# Altium schematic sheet FPGA.SCHDOC
size B
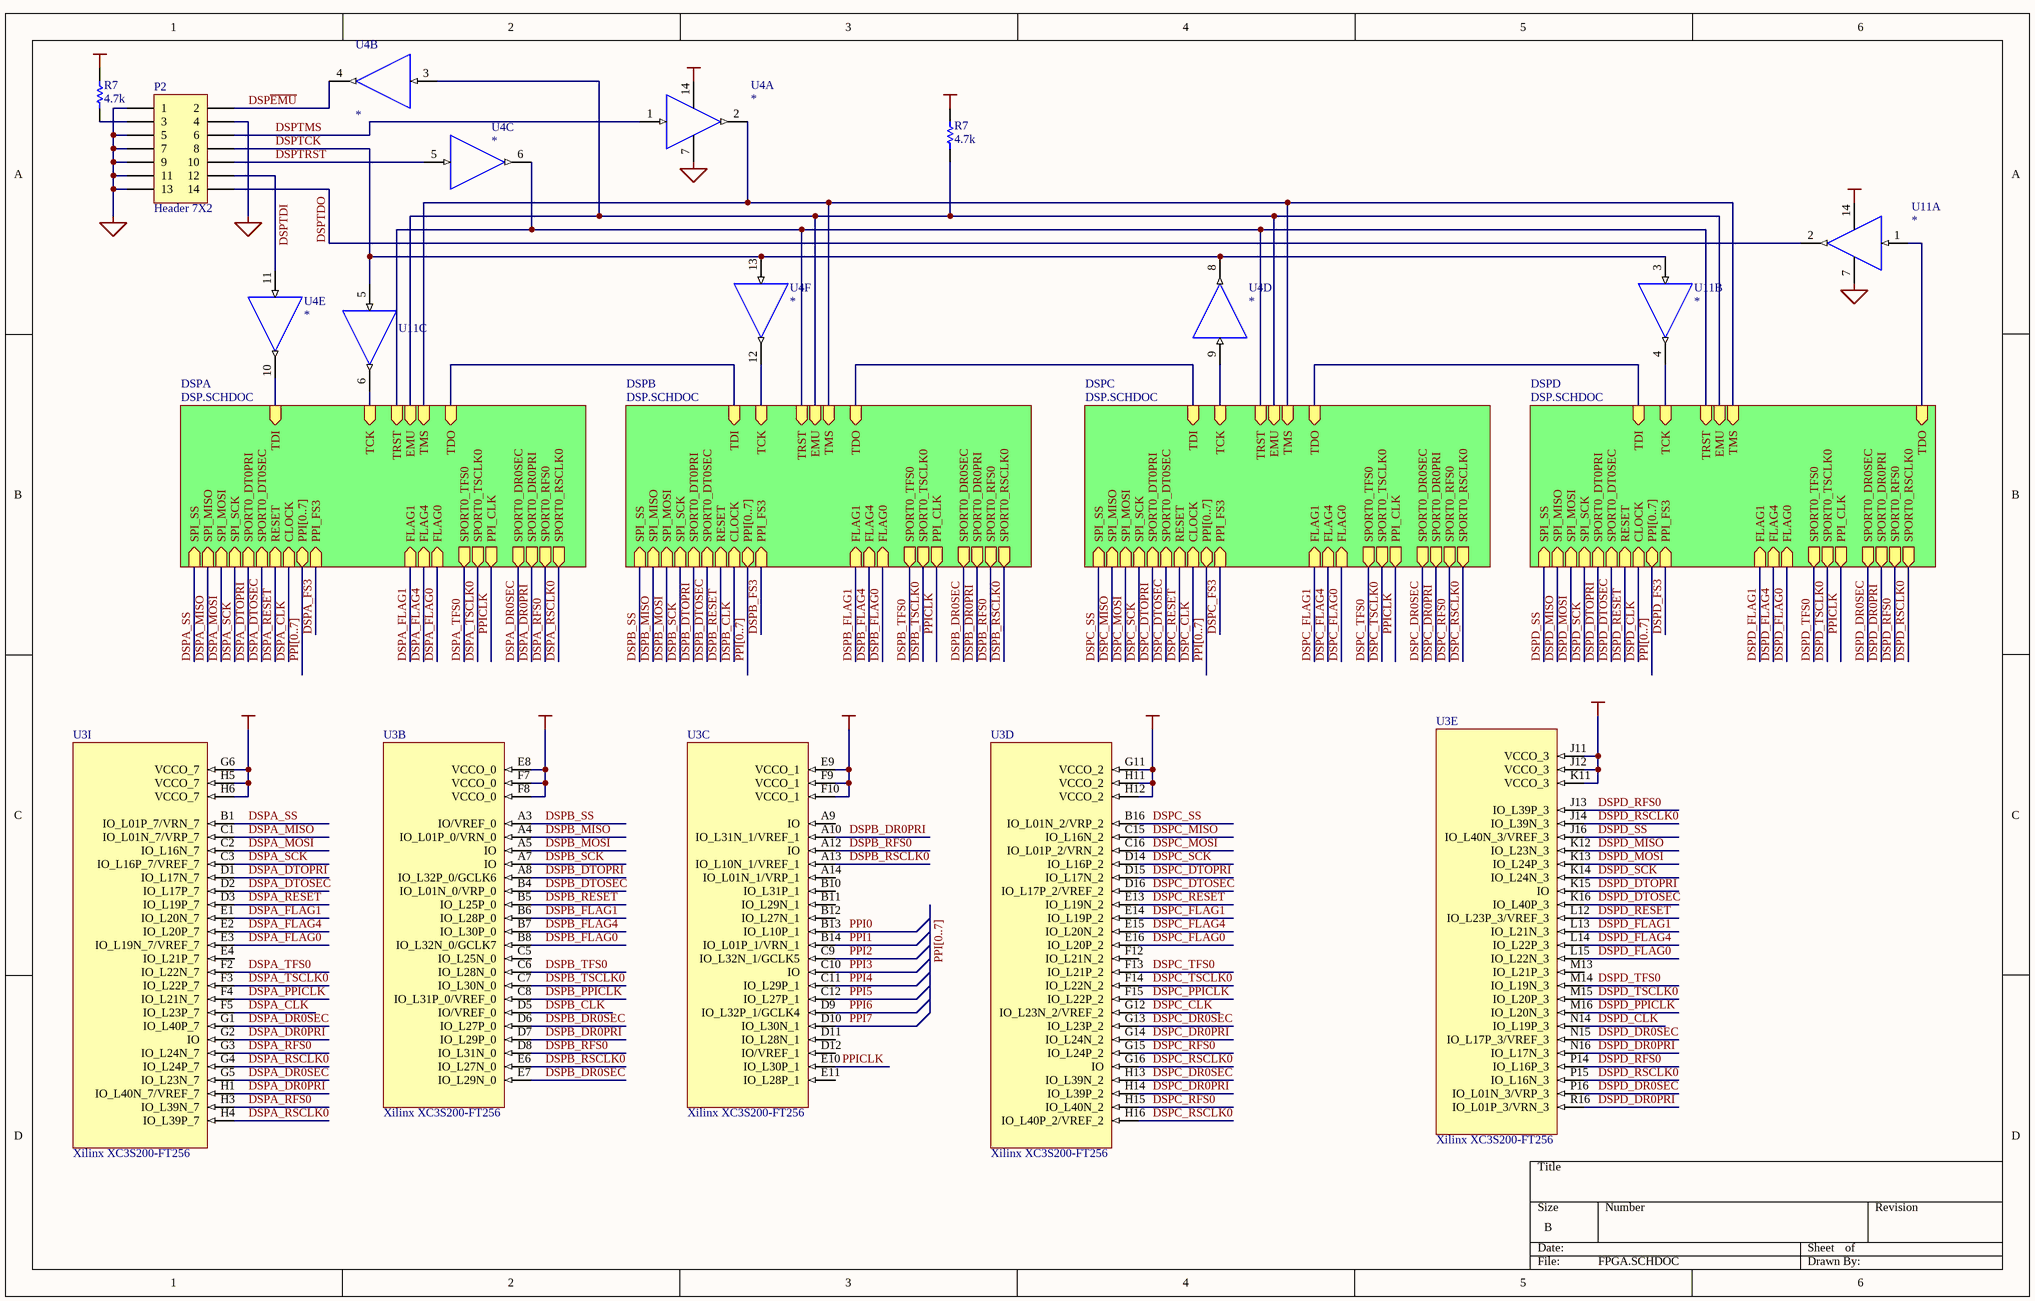
[diagram p0: FPGA.SCHDOC]

## Parts
(Parts that share a designator on the sheet are numbered #1, #2 ... from top to bottom, then left to right.)
P2  Header 7X2  [HDR2X7]
R7#1  4.7k  [CR1608-0603]
R7#2  4.7k  [CR1608-0603]
U3  Xilinx XC3S200-FT256  [Xilinx FT256 BGA]  (parts B,C,D,E,I of 9)
U4  *  [TSSO4x6-G14]  (parts A,B,C,D,E,F of 6)
U11  *  [TSSO4x6-G14]  (parts A,B,C of 6)

## Sub-sheets
DSPA = DSP.SCHDOC: SPI_SS (in), SPI_MISO (in), SPI_MOSI (in), SPI_SCK (in), SPORT0_RSCLK0 (out), SPORT0_RFS0 (out), SPORT0_DR0PRI (out), SPORT0_DR0SEC (out), SPORT0_TSCLK0 (out), SPORT0_TFS0 (out), SPORT0_DT0PRI (in), SPORT0_DT0SEC (in), RESET (in), CLOCK (in), PPI_CLK (out), PPI[0..7] (bidir), PPI_FS3 (in), TCK (in), TDI (in), TRST (in), EMU (in), TMS (in), TDO (in), FLAG1 (in), FLAG4 (in), FLAG0 (in)
DSPB = DSP.SCHDOC: SPI_SS (in), SPI_MISO (in), SPI_MOSI (in), SPI_SCK (in), SPORT0_RSCLK0 (out), SPORT0_RFS0 (out), SPORT0_DR0PRI (out), SPORT0_DR0SEC (out), SPORT0_TSCLK0 (out), SPORT0_TFS0 (out), SPORT0_DT0PRI (in), SPORT0_DT0SEC (in), RESET (in), CLOCK (in), PPI_CLK (out), PPI[0..7] (bidir), PPI_FS3 (in), TCK (in), TDI (in), TRST (in), EMU (in), TMS (in), TDO (in), FLAG1 (in), FLAG4 (in), FLAG0 (in)
DSPC = DSP.SCHDOC: SPI_SS (in), SPI_MISO (in), SPI_MOSI (in), SPI_SCK (in), SPORT0_RSCLK0 (out), SPORT0_RFS0 (out), SPORT0_DR0PRI (out), SPORT0_DR0SEC (out), SPORT0_TSCLK0 (out), SPORT0_TFS0 (out), SPORT0_DT0PRI (in), SPORT0_DT0SEC (in), RESET (in), CLOCK (in), PPI_CLK (out), PPI[0..7] (bidir), PPI_FS3 (in), TCK (in), TDI (in), TRST (in), EMU (in), TMS (in), TDO (in), FLAG1 (in), FLAG4 (in), FLAG0 (in)
DSPD = DSP.SCHDOC: SPI_SS (in), SPI_MISO (in), SPI_MOSI (in), SPI_SCK (in), SPORT0_RSCLK0 (out), SPORT0_RFS0 (out), SPORT0_DR0PRI (out), SPORT0_DR0SEC (out), SPORT0_TSCLK0 (out), SPORT0_TFS0 (out), SPORT0_DT0PRI (in), SPORT0_DT0SEC (in), RESET (in), CLOCK (in), PPI_CLK (out), PPI[0..7] (bidir), PPI_FS3 (in), TCK (in), TDI (in), TRST (in), EMU (in), TMS (in), TDO (in), FLAG1 (in), FLAG4 (in), FLAG0 (in)

## Nets
GND: P2.1 P2.4 P2.5 P2.7 P2.9 P2.11 P2.13 U4.7(GND) U11.7(GND)
VCC: R7#1.2 R7#2.2 U3.E8(VCCO_0) U3.E9(VCCO_1) U3.F7(VCCO_0) U3.F8(VCCO_0) U3.F9(VCCO_1) U3.F10(VCCO_1) U3.G6(VCCO_7) U3.G11(VCCO_2) U3.H5(VCCO_7) U3.H6(VCCO_7) U3.H11(VCCO_2) U3.H12(VCCO_2) U3.J11(VCCO_3) U3.J12(VCCO_3) U3.K11(VCCO_3) U4.14(VCC) U11.14(VCC)
DSPA_CLK: U3.F5(IO_L23P_7) ; sheet DSPA/CLOCK
DSPA_DR0PRI: U3.G2(IO) U3.H1(IO_L40N_7/VREF_7) ; sheet DSPA/SPORT0_DR0PRI
DSPA_DR0SEC: U3.G1(IO_L40P_7) U3.G5(IO_L23N_7) ; sheet DSPA/SPORT0_DR0SEC
DSPA_DTOPRI: U3.D1(IO_L17N_7) ; sheet DSPA/SPORT0_DT0PRI
DSPA_DTOSEC: U3.D2(IO_L17P_7) ; sheet DSPA/SPORT0_DT0SEC
DSPA_FLAG0: U3.E3(IO_L19N_7/VREF_7) ; sheet DSPA/FLAG0
DSPA_FLAG1: U3.E1(IO_L20N_7) ; sheet DSPA/FLAG1
DSPA_FLAG4: U3.E2(IO_L20P_7) ; sheet DSPA/FLAG4
DSPA_FS3: sheet DSPA/PPI_FS3
DSPA_MISO: U3.C1(IO_L01N_7/VRP_7) ; sheet DSPA/SPI_MISO
DSPA_MOSI: U3.C2(IO_L16N_7) ; sheet DSPA/SPI_MOSI
DSPA_PPICLK: U3.F4(IO_L21N_7)
DSPA_RESET: U3.D3(IO_L19P_7) ; sheet DSPA/RESET
DSPA_RFS0: U3.G3(IO_L24N_7) U3.H3(IO_L39N_7) ; sheet DSPA/SPORT0_RFS0
DSPA_RSCLK0: U3.G4(IO_L24P_7) U3.H4(IO_L39P_7) ; sheet DSPA/SPORT0_RSCLK0
DSPA_SCK: U3.C3(IO_L16P_7/VREF_7) ; sheet DSPA/SPI_SCK
DSPA_SS: U3.B1(IO_L01P_7/VRN_7) ; sheet DSPA/SPI_SS
DSPA_TFS0: U3.F2(IO_L22N_7) ; sheet DSPA/SPORT0_TFS0
DSPA_TSCLK0: U3.F3(IO_L22P_7) ; sheet DSPA/SPORT0_TSCLK0
DSPB_CLK: U3.D5(IO/VREF_0) ; sheet DSPB/CLOCK
DSPB_DR0PRI: U3.A10(IO_L31N_1/VREF_1) U3.D7(IO_L29P_0) ; sheet DSPB/SPORT0_DR0PRI
DSPB_DR0SEC: U3.D6(IO_L27P_0) U3.E7(IO_L29N_0) ; sheet DSPB/SPORT0_DR0SEC
DSPB_DTOPRI: U3.A8(IO_L32P_0/GCLK6) ; sheet DSPB/SPORT0_DT0PRI
DSPB_DTOSEC: U3.B4(IO_L01N_0/VRP_0) ; sheet DSPB/SPORT0_DT0SEC
DSPB_FLAG0: U3.B8(IO_L32N_0/GCLK7) ; sheet DSPB/FLAG0
DSPB_FLAG1: U3.B6(IO_L28P_0) ; sheet DSPB/FLAG1
DSPB_FLAG4: U3.B7(IO_L30P_0) ; sheet DSPB/FLAG4
DSPB_FS3: sheet DSPB/PPI_FS3
DSPB_MISO: U3.A4(IO_L01P_0/VRN_0) ; sheet DSPB/SPI_MISO
DSPB_MOSI: U3.A5(IO) ; sheet DSPB/SPI_MOSI
DSPB_PPICLK: U3.C8(IO_L31P_0/VREF_0)
DSPB_RESET: U3.B5(IO_L25P_0) ; sheet DSPB/RESET
DSPB_RFS0: U3.A12(IO) U3.D8(IO_L31N_0) ; sheet DSPB/SPORT0_RFS0
DSPB_RSCLK0: U3.A13(IO_L10N_1/VREF_1) U3.E6(IO_L27N_0) ; sheet DSPB/SPORT0_RSCLK0
DSPB_SCK: U3.A7(IO) ; sheet DSPB/SPI_SCK
DSPB_SS: U3.A3(IO/VREF_0) ; sheet DSPB/SPI_SS
DSPB_TFS0: U3.C6(IO_L28N_0) ; sheet DSPB/SPORT0_TFS0
DSPB_TSCLK0: U3.C7(IO_L30N_0) ; sheet DSPB/SPORT0_TSCLK0
DSPC_CLK: U3.G12(IO_L23N_2/VREF_2) ; sheet DSPC/CLOCK
DSPC_DR0PRI: U3.G14(IO_L24N_2) U3.H14(IO_L39P_2) ; sheet DSPC/SPORT0_DR0PRI
DSPC_DR0SEC: U3.G13(IO_L23P_2) U3.H13(IO_L39N_2) ; sheet DSPC/SPORT0_DR0SEC
DSPC_DTOPRI: U3.D15(IO_L17N_2) ; sheet DSPC/SPORT0_DT0PRI
DSPC_DTOSEC: U3.D16(IO_L17P_2/VREF_2) ; sheet DSPC/SPORT0_DT0SEC
DSPC_FLAG0: U3.E16(IO_L20P_2) ; sheet DSPC/FLAG0
DSPC_FLAG1: U3.E14(IO_L19P_2) ; sheet DSPC/FLAG1
DSPC_FLAG4: U3.E15(IO_L20N_2) ; sheet DSPC/FLAG4
DSPC_FS3: sheet DSPC/PPI_FS3
DSPC_MISO: U3.C15(IO_L16N_2) ; sheet DSPC/SPI_MISO
DSPC_MOSI: U3.C16(IO_L01P_2/VRN_2) ; sheet DSPC/SPI_MOSI
DSPC_PPICLK: U3.F15(IO_L22P_2)
DSPC_RESET: U3.E13(IO_L19N_2) ; sheet DSPC/RESET
DSPC_RFS0: U3.G15(IO_L24P_2) U3.H15(IO_L40N_2) ; sheet DSPC/SPORT0_RFS0
DSPC_RSCLK0: U3.G16(IO) U3.H16(IO_L40P_2/VREF_2) ; sheet DSPC/SPORT0_RSCLK0
DSPC_SCK: U3.D14(IO_L16P_2) ; sheet DSPC/SPI_SCK
DSPC_SS: U3.B16(IO_L01N_2/VRP_2) ; sheet DSPC/SPI_SS
DSPC_TFS0: U3.F13(IO_L21P_2) ; sheet DSPC/SPORT0_TFS0
DSPC_TSCLK0: U3.F14(IO_L22N_2) ; sheet DSPC/SPORT0_TSCLK0
DSPD_CLK: U3.N14(IO_L19P_3) ; sheet DSPD/CLOCK
DSPD_DR0PRI: U3.N16(IO_L17N_3) U3.R16(IO_L01P_3/VRN_3) ; sheet DSPD/SPORT0_DR0PRI
DSPD_DR0SEC: U3.N15(IO_L17P_3/VREF_3) U3.P16(IO_L01N_3/VRP_3) ; sheet DSPD/SPORT0_DR0SEC
DSPD_DTOPRI: U3.K15(IO) ; sheet DSPD/SPORT0_DT0PRI
DSPD_DTOSEC: U3.K16(IO_L40P_3) ; sheet DSPD/SPORT0_DT0SEC
DSPD_FLAG0: U3.L15(IO_L22N_3) ; sheet DSPD/FLAG0
DSPD_FLAG1: U3.L13(IO_L21N_3) ; sheet DSPD/FLAG1
DSPD_FLAG4: U3.L14(IO_L22P_3) ; sheet DSPD/FLAG4
DSPD_FS3: sheet DSPD/PPI_FS3
DSPD_MISO: U3.K12(IO_L23N_3) ; sheet DSPD/SPI_MISO
DSPD_MOSI: U3.K13(IO_L24P_3) ; sheet DSPD/SPI_MOSI
DSPD_PPICLK: U3.M16(IO_L20N_3)
DSPD_RESET: U3.L12(IO_L23P_3/VREF_3) ; sheet DSPD/RESET
DSPD_RFS0: U3.J13(IO_L39P_3) U3.P14(IO_L16P_3) ; sheet DSPD/SPORT0_RFS0
DSPD_RSCLK0: U3.J14(IO_L39N_3) U3.P15(IO_L16N_3) ; sheet DSPD/SPORT0_RSCLK0
DSPD_SCK: U3.K14(IO_L24N_3) ; sheet DSPD/SPI_SCK
DSPD_SS: U3.J16(IO_L40N_3/VREF_3) ; sheet DSPD/SPI_SS
DSPD_TFS0: U3.M14(IO_L19N_3) ; sheet DSPD/SPORT0_TFS0
DSPD_TSCLK0: U3.M15(IO_L20P_3) ; sheet DSPD/SPORT0_TSCLK0
DSP~{EMU}: P2.2 U4.4(OUT)
DSP~{TRST}: P2.10 U4.5(IN)
DSPTCK: P2.8 U4.8(OUT) U4.13(IN) U11.3(IN) U11.5(IN)
DSPTDI: P2.12 U4.11(IN)
DSPTDO: P2.14 U11.2(OUT)
DSPTMS: P2.6 U4.1(IN)
PPI0: U3.B13(IO_L10P_1)
PPI1: U3.B14(IO_L01P_1/VRN_1)
PPI2: U3.C9(IO_L32N_1/GCLK5)
PPI3: U3.C10(IO)
PPI4: U3.C11(IO_L29P_1)
PPI5: U3.C12(IO_L27P_1)
PPI6: U3.D9(IO_L32P_1/GCLK4)
PPI7: U3.D10(IO_L30N_1)
PPICLK: U3.E10(IO_L30P_1) ; sheet DSPA/PPI_CLK, sheet DSPB/PPI_CLK, sheet DSPC/PPI_CLK, sheet DSPD/PPI_CLK
NetP2_3: P2.3 R7#1.1
NetR7#2_1: R7#2.1 U4.3(IN) ; sheet DSPA/EMU, sheet DSPB/EMU, sheet DSPC/EMU, sheet DSPD/EMU
NetU4_2: U4.2(OUT) ; sheet DSPA/TMS, sheet DSPB/TMS, sheet DSPC/TMS, sheet DSPD/TMS
NetU4_6: U4.6(OUT) ; sheet DSPA/TRST, sheet DSPB/TRST, sheet DSPC/TRST, sheet DSPD/TRST
NetU4_9: U4.9(IN) ; sheet DSPC/TCK
NetU4_10: U4.10(OUT) ; sheet DSPA/TDI
NetU4_12: U4.12(OUT) ; sheet DSPB/TCK
NetU11_1: U11.1(IN) ; sheet DSPD/TDO
NetU11_4: U11.4(OUT) ; sheet DSPD/TCK
NetU11_6: U11.6(OUT) ; sheet DSPA/TCK
(unnamed): sheet DSPA/TDO, sheet DSPB/TDI
(unnamed): sheet DSPB/TDO, sheet DSPC/TDI
(unnamed): sheet DSPC/TDO, sheet DSPD/TDI

Not connected (* = marked no-connect by the designer): U3 A9(IO) A14(IO_L01N_1/VRP_1) B10(IO_L31P_1) B11(IO_L29N_1) B12(IO_L27N_1) C5(IO_L25N_0) D11(IO_L28N_1) D12(IO/VREF_1) E4(IO_L21P_7) E11(IO_L28P_1) F12(IO_L21N_2) M13(IO_L21P_3)

## Buses and harness runs
bus PPI[0..7]
bus PPI[0..7] = sheet DSPA/PPI[0..7]
bus PPI[0..7] = sheet DSPB/PPI[0..7]
bus PPI[0..7] = sheet DSPC/PPI[0..7]
bus PPI[0..7] = sheet DSPD/PPI[0..7]

## Library data of the parts
P2 = Header 7X2: Header, 7-Pin, Dual row; LatestRevisionDate: 17-Jul-2002; LatestRevisionNote: Re-released for DXP Platform.; Publisher: Altium Limited
R7#1 R7#2 = Res1: Resistor; Published: 8-Jun-2000; LatestRevisionDate: 17-Jul-2002; LatestRevisionNote: Re-released for DXP Platform.; Publisher: Altium Limited
U3 = XC3S200-FT256: Xilinx Spartan-3 FPGA
U4 U11 = SN54LVC07A